# Altium schematic sheet ETHERNET.SchDoc
size A4
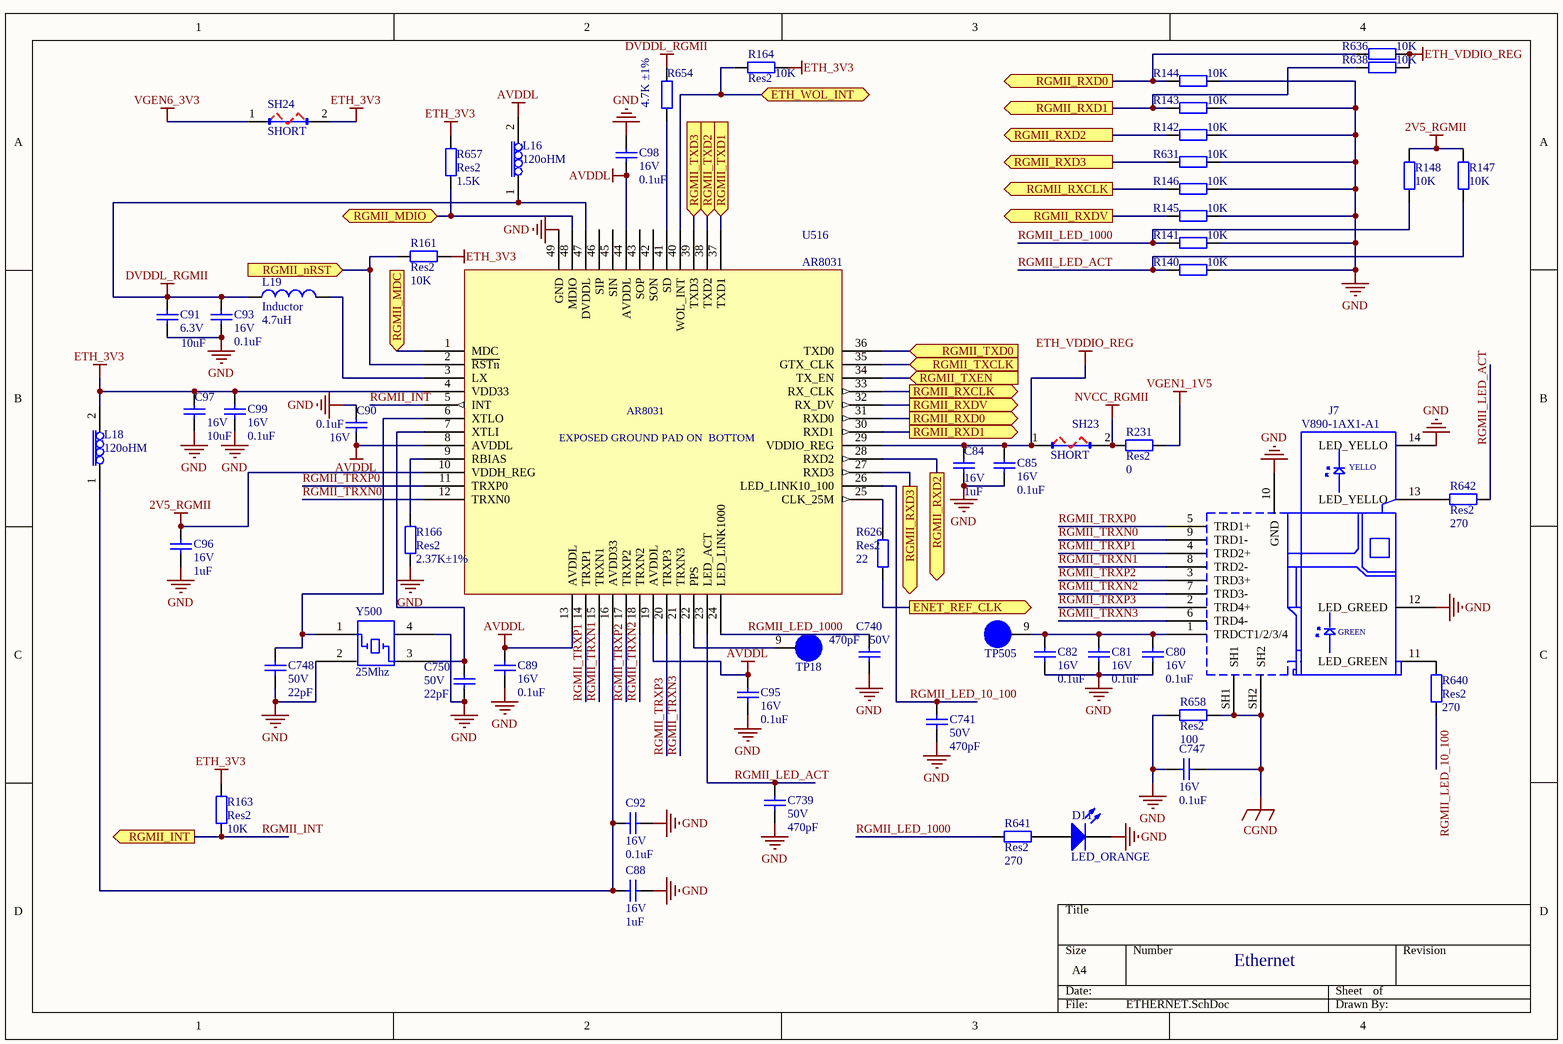
[diagram p0: ETHERNET.SchDoc]

## Parts
C80  16V  value 0.1uF  [0402]
C81  16V  value 0.1uF  [0402]
C82  16V  value 0.1uF  [0402]
C84  16V  value 1uF  [0603]
C85  16V  value 0.1uF  [0402]
C88  16V  value 1uF  [0603]
C89  16V  value 0.1uF  [0402]
C90  16V  value 0.1uF  [0402]
C91  6.3V  value 10uF  [0603]
C92  16V  value 0.1uF  [0402]
C93  16V  value 0.1uF  [0402]
C95  16V  value 0.1uF  [0402]
C96  16V  value 1uF  [0603]
C97  16V  value 10uF  [0603]
C98  16V  value 0.1uF  [0402]
C99  16V  value 0.1uF  [0402]
C739  50V  value 470pF  [0402]
C740  50V  value 470pF  [0402]
C741  50V  value 470pF  [0402]
C747  16V  value 0.1uF  [0402]
C748  50V  value 22pF  [0402]
C750  50V  value 22pF  [0402]
D11  LED_ORANGE  [LED_0603]
J7  V890-1AX1-A1  [V890-1AX1-A1]
L16  120oHM  [0603]
L18  120oHM  [0603]
L19  Inductor  value 4.7uH  [VLS3012-4R7M1R0]
R140  value 10K  [0402]  (hidden comment: Res2)
R141  value 10K  [0402]  (hidden comment: Res2)
R142  value 10K  [0402]  (hidden comment: Res2)
R143  value 10K  [0402]  (hidden comment: Res2)
R144  value 10K  [0402]  (hidden comment: Res2)
R145  value 10K  [0402]  (hidden comment: Res2)
R146  value 10K  [0402]  (hidden comment: Res2)
R147  value 10K  [0402]  (hidden comment: Res2)
R148  value 10K  [0402]  (hidden comment: Res2)
R161  Res2  value 10K  [0402]
R163  Res2  value 10K  [0402]
R164  Res2  value 10K  [0402]
R166  Res2  value 2.37K±1%  [0402]
R231  Res2  value 0  [0603]
R626  Res2  value 22  [0603]
R631  value 10K  [0402]  (hidden comment: Res2)
R636  value 10K  [0402]  (hidden comment: Res2)
R638  value 10K  [0402]  (hidden comment: Res2)
R640  Res2  value 270  [0402]
R641  Res2  value 270  [0402]
R642  Res2  value 270  [0402]
R654  ±1%  value 4.7K  [0402]
R657  Res2  value 1.5K  [0402]
R658  Res2  value 100  [0402]
SH23  SHORT  [SHORT_SH]
SH24  SHORT  [SHORT_SH]
TP18  TP test  (value not drawn)
TP505  TP test  (value not drawn)
U516  AR8031  [AR8031]
Y500  25Mhz  [XTAL-ABMM-25M]

## Ports
ENET_REF_CLK (out), ETH_WOL_INT, RGMII_INT (out), RGMII_MDC (in), RGMII_MDIO, RGMII_nRST (in), RGMII_RXCLK (out), RGMII_RXD0 (out), RGMII_RXD1 (out), RGMII_RXD2 (out), RGMII_RXD3 (out), RGMII_RXDV (out), RGMII_TXCLK (in), RGMII_TXD0 (in), RGMII_TXD1 (in), RGMII_TXD2 (in), RGMII_TXD3 (in), RGMII_TXEN (in)

## Nets
2V5_RGMII: C96.2 R147.2 R148.2 U516.10(VDDH_REG)
AVDDL: C89.2 C90.1 C95.2 C98.2 L16.2(VSS4) U516.8(AVDDL) U516.13(AVDDL) U516.19(AVDDL) U516.44(AVDDL)
CGND: C747.1 J7.SH1 J7.SH2 R658.1
DVDDL_RGMII: C91.2 C93.2 L16.1(VSS3) L19.1 R654.2 U516.47(DVDDL)
ETH_3V3: C97.2 C99.2 L18.2(VSS4) R161.2 R163.2 R164.1 R657.2 SH24.2(VCCIO) U516.4(VDD33)
ETH_VDDIO_REG: C84.2 C85.2 R636.1 R638.1 SH23.1(VCCIO) U516.29(VDDIO_REG)
GND: C80.1 C81.1 C82.1 C84.1 C85.1 C88.1 C89.1 C90.2 C91.1 C92.1 C93.1 C95.1 C96.1 C97.1 C98.1 C99.1 C739.1 C740.2 C741.1 C747.2 C748.1 C750.1 D11.2(K) J7.10(GND) J7.12(LED_GREED) J7.14(LED_YELLO) R140.2 R141.2 R142.2 R143.2 R144.2 R145.2 R146.2 R166.1 R631.2 R658.2 U516.49(GND) Y500.2 Y500.4
NVCC_RGMII: R231.2 SH23.2(VCCIO)
VGEN1_1V5: R231.1
VGEN6_3V3: SH24.1(VCCIO)
ENET_REF_CLK: R626.2 ; port ENET_REF_CLK
ETH_WOL_INT: R164.2 U516.40(WOL_INT) ; port ETH_WOL_INT
RGMII_INT: R163.1 U516.5(INT) ; port RGMII_INT
RGMII_LED_10_100: C741.2 R640.1 U516.26(LED_LINK10_100)
RGMII_LED_1000: C740.1 R141.1 R148.1 R641.2 U516.24(LED_LINK1000)
RGMII_LED_ACT: C739.2 R140.1 R147.1 R642.1 U516.23(LED_ACT)
RGMII_MDC: U516.1(MDC) ; port RGMII_MDC
RGMII_MDIO: R657.1 U516.48(MDIO) ; port RGMII_MDIO
RGMII_nRST: R161.1 U516.2(~{RSTn}) ; port RGMII_nRST
RGMII_RXCLK: R146.1 U516.33(RX_CLK) ; port RGMII_RXCLK
RGMII_RXD0: R144.1 R636.2 U516.31(RXD0) ; port RGMII_RXD0
RGMII_RXD1: R143.1 R638.2 U516.30(RXD1) ; port RGMII_RXD1
RGMII_RXD2: R142.1 U516.28(RXD2) ; port RGMII_RXD2
RGMII_RXD3: R631.1 U516.27(RXD3) ; port RGMII_RXD3
RGMII_RXDV: R145.1 U516.32(RX_DV) ; port RGMII_RXDV
RGMII_TRXN0: J7.9(TRD1-) U516.12(TRXN0)
RGMII_TRXN1: J7.8(TRD2-) U516.15(TRXN1)
RGMII_TRXN2: J7.7(TRD3-) U516.18(TRXN2)
RGMII_TRXN3: J7.6(TRD4-) U516.21(TRXN3)
RGMII_TRXP0: J7.5(TRD1+) U516.11(TRXP0)
RGMII_TRXP1: J7.4(TRD2+) U516.14(TRXP1)
RGMII_TRXP2: J7.3(TRD3+) U516.17(TRXP2)
RGMII_TRXP3: J7.2(TRD4+) U516.20(TRXP3)
RGMII_TXCLK: U516.35(GTX_CLK) ; port RGMII_TXCLK
RGMII_TXD0: U516.36(TXD0) ; port RGMII_TXD0
RGMII_TXD1: U516.37(TXD1) ; port RGMII_TXD1
RGMII_TXD2: U516.38(TXD2) ; port RGMII_TXD2
RGMII_TXD3: U516.39(TXD3) ; port RGMII_TXD3
RGMII_TXEN: U516.34(TX_EN) ; port RGMII_TXEN
NetC80_2: C80.2 C81.2 C82.2 J7.1(TRDCT1/2/3/4) TP505.9(S)
NetC88_2: C88.2 C92.2 L18.1(VSS3) U516.16(AVDD33)
NetC748_2: C748.2 U516.6(XTLO) Y500.1
NetC750_2: C750.2 U516.7(XTLI) Y500.3
NetD11_1: D11.1(A) R641.1
NetJ7_11: J7.11(LED_GREEN) R640.2
NetJ7_13: J7.13(LED_YELLO) R642.2
NetL19_2: L19.2 U516.3(LX)
NetR166_2: R166.2 U516.9(RBIAS)
NetR626_1: R626.1 U516.25(CLK_25M)
NetR654_1: R654.1 U516.41(SD)
NetTP18_9: TP18.9(S) U516.22(PPS)

Not connected (* = marked no-connect by the designer): U516 42(SON) 43(SOP) 45(SIN) 46(SIP)

## Notes on the sheet
- Ethernet
- (in symbol AR8031) EXPOSED GROUND PAD ON  BOTTOM
- (in symbol Ethernet PORT) YELLO; GREEN

## Library data of the parts
C80-C82 C84 C85 C88-C93 C95-C99 C739-C741 C747 C748 C750 = Cap: Capacitor; Published: 8-Jun-2000; LatestRevisionDate: 17-Jul-2002; LatestRevisionNote: Re-released for DXP Platform.; PackageReference: RAD-0.3; Publisher: Altium Limited
D11 = LED0: Typical INFRARED GaAs LED; Published: 8-Jun-2000; LatestRevisionDate: 08-Jul-2005; LatestRevisionNote: Mech Layer 1 removed.; PackageReference: LED-0; Publisher: Altium Limited
J7 = Ethernet PORT
L16 L18 = magnetic BEAD
L19 = Inductor: Code_IEC: 1005; Published: 8-Jun-2000; LatestRevisionDate: 29-May-2009; LatestRevisionNote: IPC-7351 Footprint Added.; PackageReference: 0402-A; Publisher: Altium Limited; PackageDescription: Chip Inductor; Code_JEITA: 0402
R140-R148 R161 R163 R164 R166 R231 R626 R631 R636 R638 R640-R642 R654 R657 R658 = Res2: Resistor; Published: 8-Jun-2000; LatestRevisionDate: 17-Jul-2002; LatestRevisionNote: Re-released for DXP Platform.; PackageReference: AXIAL-0.4; Publisher: Altium Limited
SH23 SH24 = SOLDER SHORT
Y500 = XTAL